# Altium schematic sheet Power_revB3.SchDoc
size A3; SheetNumber: 3; SheetTotal: 3
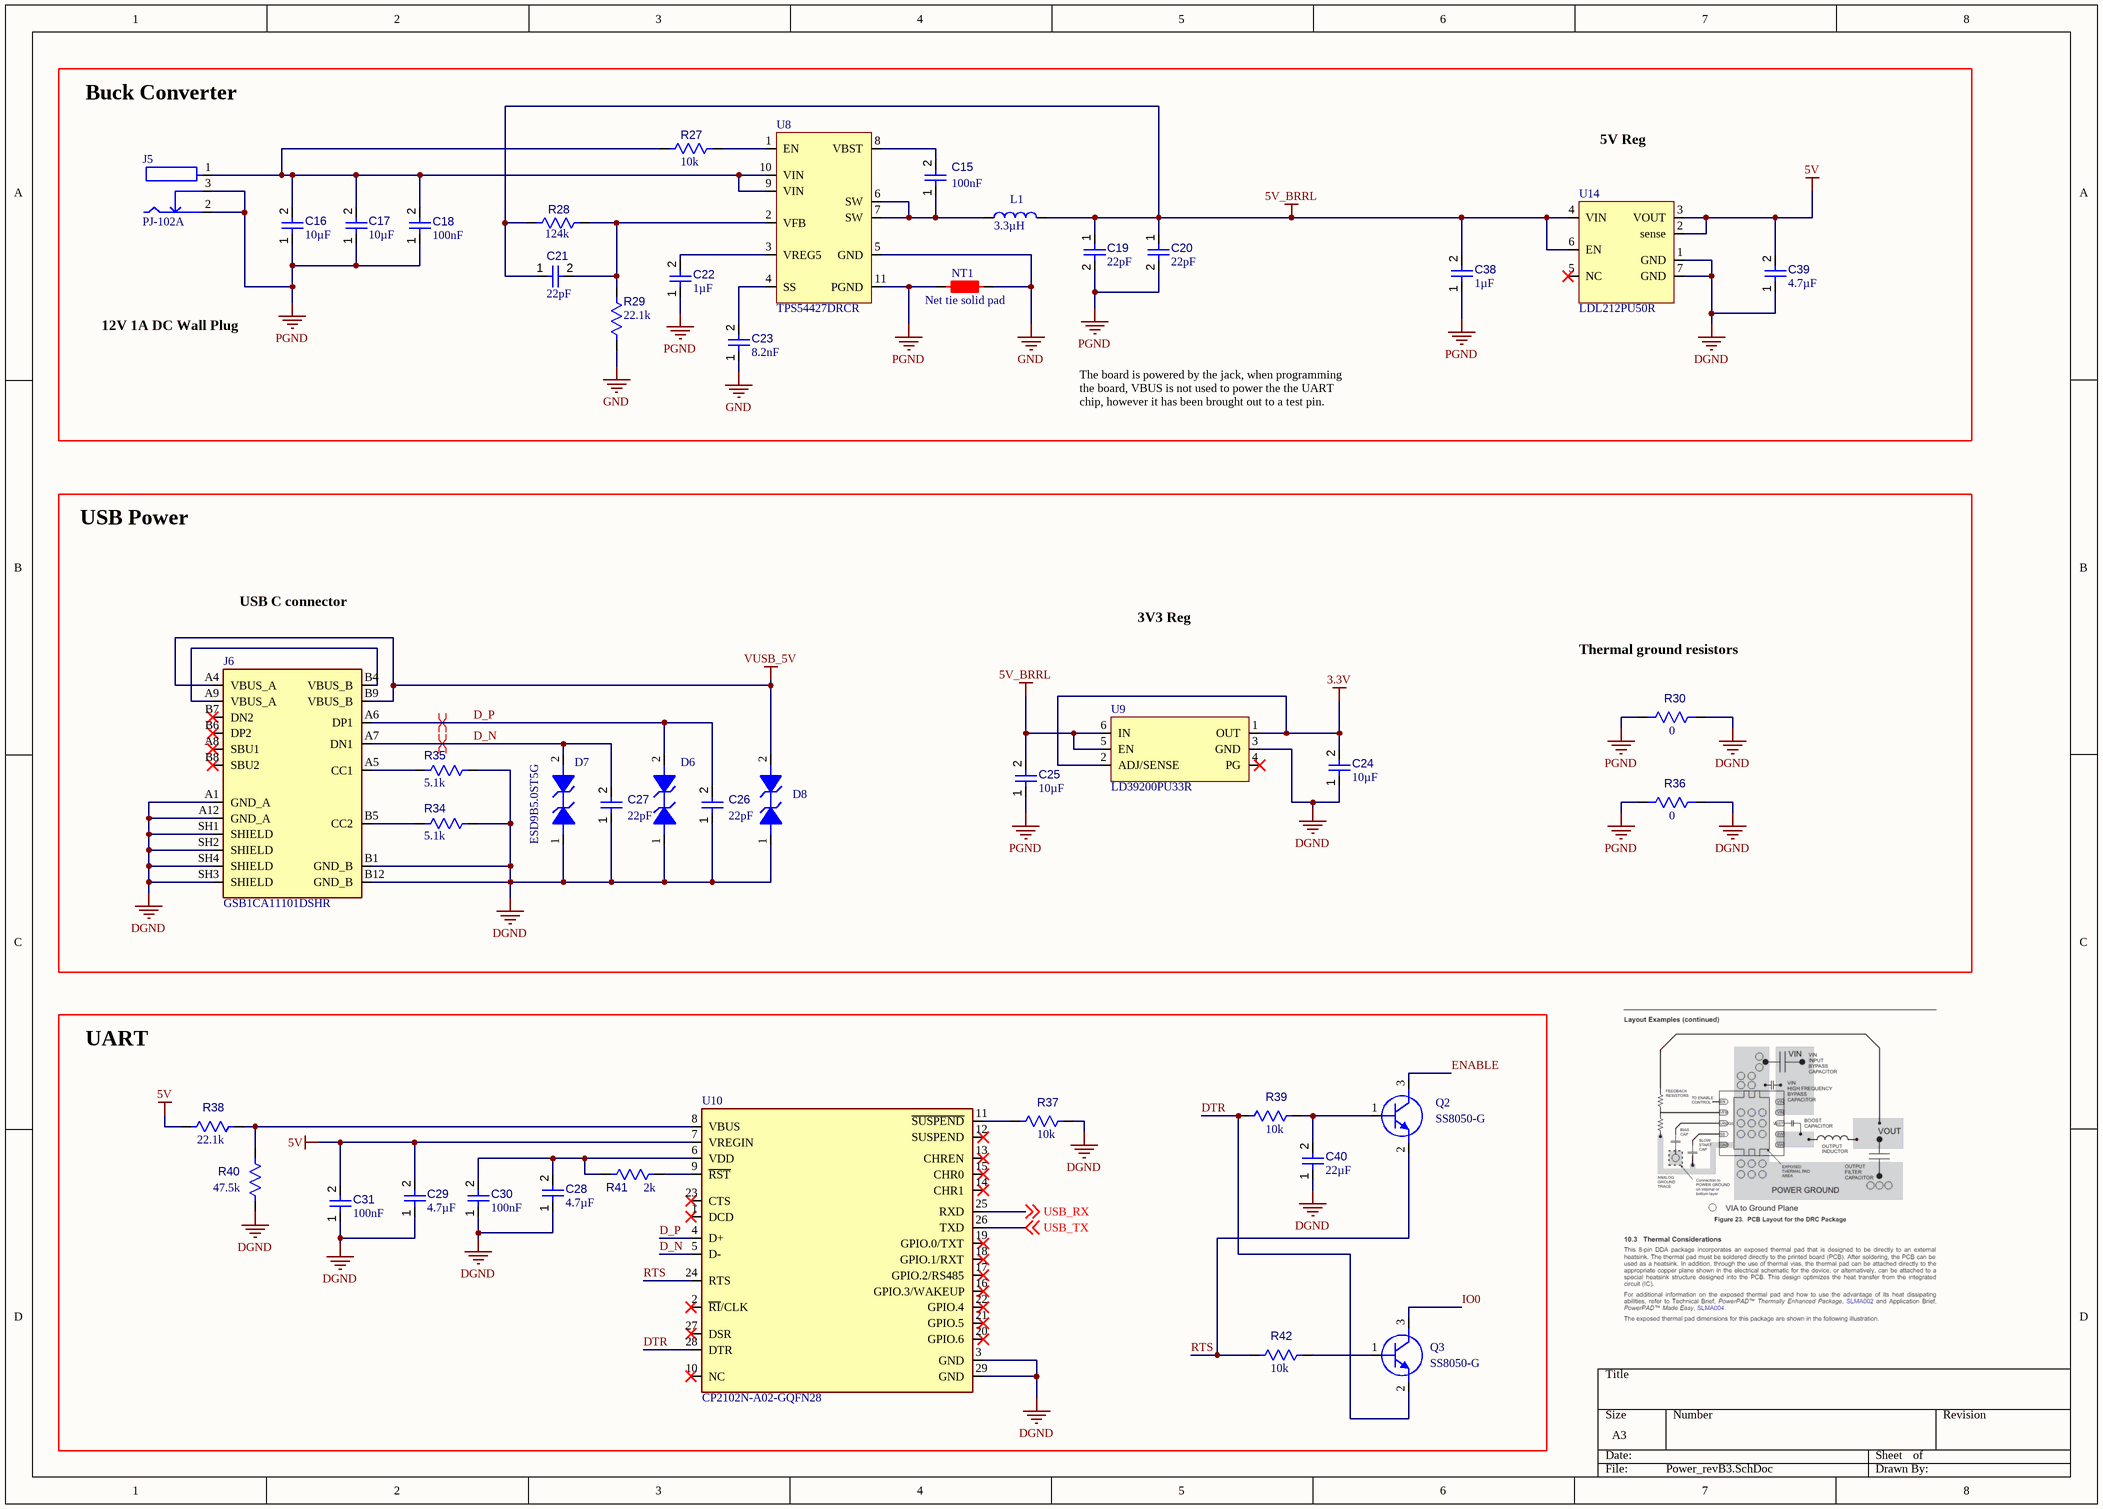
[diagram p0: Power_revB3.SchDoc]

## Parts
C15  value 100nF  [MANUF_CAP_0603]  (hidden comment: CC0603KRX7R7BB104)
C16  value 10µF  [FP-1210-L_3_2_0_3-W_2_5_0-MFG]  (hidden comment: C1210C106M3RACTU)
C17  value 10µF  [FP-1210-L_3_2_0_3-W_2_5_0-MFG]  (hidden comment: C1210C106M3RACTU)
C18  value 100nF  [MANUF_CAP_0603]  (hidden comment: CC0603KRX7R7BB104)
C19  value 22pF  [MANUF_CAP_0603]  (hidden comment: C0603C220J5GACTU)
C20  value 22pF  [MANUF_CAP_0603]  (hidden comment: C0603C220J5GACTU)
C21  value 22pF  [MANUF_CAP_0603]  (hidden comment: C0603C220J5GACTU)
C22  value 1µF  [MANUF_CAP_0603]  (hidden comment: CL10B105KA8NFNC)
C23  value 8.2nF  [FP-GRM188-0_1-e0_2_0_5-MFG]  (hidden comment: GRM1885C1H822JA01D)
C24  value 10µF  [FP-CL21B106KOQNNNE-IPC_A]  (hidden comment: CL21B106KOQNNNE)
C25  value 10µF  [FP-CL21B106KOQNNNE-IPC_A]  (hidden comment: CL21B106KOQNNNE)
C26  value 22pF  [CAPC0402(1005)60_L]  (hidden comment: Capacitor 22pF +/-10% 50V 0402)
C27  value 22pF  [CAPC0402(1005)60_L]  (hidden comment: Capacitor 22pF +/-10% 50V 0402)
C28  value 4.7µF  [MANUF_CAP_0603]  (hidden comment: Capacitor 4.7µF +/-20% 10V 0603)
C29  value 4.7µF  [MANUF_CAP_0603]  (hidden comment: Capacitor 4.7µF +/-20% 10V 0603)
C30  value 100nF  [MANUF_CAP_0603]  (hidden comment: CC0603KRX7R7BB104)
C31  value 100nF  [MANUF_CAP_0603]  (hidden comment: CC0603KRX7R7BB104)
C38  value 1µF  [MANUF_CAP_0603]  (hidden comment: CL10B105KA8NFNC)
C39  value 4.7µF  [MANUF_CAP_0603]  (hidden comment: Capacitor 4.7µF +/-20% 10V 0603)
C40  value 22µF  [FP-GRM21B-0_2-e0_2_0_7-MFG]  (hidden comment: GRM21BZ71A226ME15L)  (no BOM)
D6  ESD9B5.0ST5G  [ONSC-SOD-923-2-514AB-01_V]  (value not drawn)
D7  ESD9B5.0ST5G  [ONSC-SOD-923-2-514AB-01_V]
D8  ESD9B5.0ST5G  [ONSC-SOD-923-2-514AB-01_V]  (value not drawn)
J5  PJ-102A  [FP-PJ-102A-MFG]
J6  GSB1CA11101DSHR  [GSB1CA11101DSHR-Footprint-1]
L1  value 3.3µH  [INDC4141X31N]  (hidden comment: PA5430.332NLT)
NT1  Net tie solid pad  [Net tie solid pad-Footprint-1]  (net tie, no BOM)
Q2  SS8050-G  [FP-SS8050-G-IPC_C]
Q3  SS8050-G  [FP-SS8050-G-IPC_C]
R27  value 10k  [MANUF_RES_0603]  (hidden comment: RC0603FR-0710KL)
R28  value 124k  [RESC0603(1608)_L]  (hidden comment: RCS0603124KFKEA)
R29  value 22.1k  [FP-CRCW0603-HPe3-MFG]  (hidden comment: CRCW060322K1FKEAHP)
R30  value 0  [MANUF_RES_0603]  (hidden comment: Resistor 0R +/- 5% 0603 100 mW)
R34  value 5.1k  [0805]  (hidden comment: RC0805JR-075K1L)
R35  value 5.1k  [0805]  (hidden comment: RC0805JR-075K1L)
R36  value 0  [MANUF_RES_0603]  (hidden comment: Resistor 0R +/- 5% 0603 100 mW)
R37  value 10k  [MANUF_RES_0603]  (hidden comment: RC0603FR-0710KL)
R38  value 22.1k  [MANUF_RES_0603]  (hidden comment: RMCF0603FT22K1)
R39  value 10k  [MANUF_RES_0603]  (hidden comment: RC0603FR-0710KL)
R40  value 47.5k  [MANUF_RES_0603]  (hidden comment: CRCW060347K5FKEAHP)
R41  value 2k  [MANUF_RES_0603]  (hidden comment: ERJ-3EKF2001V)
R42  value 10k  [MANUF_RES_0603]  (hidden comment: RC0603FR-0710KL)
U8  TPS54427DRCR  [SON50P300X100_HS-11N]
U9  LD39200PU33R  [FP-DFN6-7946637-MFG]
U10  CP2102N-A02-GQFN28  [FP-CP2102N-A02-GQFN28-MFG]
U14  LDL212PU50R  [FP-DFN6-7946637-MFG]

## Blocks framed on the sheet
Buck Converter: C15-C23 C38 C39 J5 L1 NT1 R27-R29 U8 U14
USB Power: C24-C27 D6-D8 J6 R30 R34-R36 U9
UART: C28-C31 C40 Q2 Q3 R37-R42 U10

## Nets
3.3V: C24.2 U9.1(OUT) U9.2(ADJ/SENSE)
5V: C29.2 C31.2 C39.2 R38.1 U10.7(VREGIN) U14.2(sense) U14.3(VOUT)
5V_BRRL: C19.1 C20.1 C21.1 C25.2 C38.2 L1.2 R28.1 U9.5(EN) U9.6(IN) U14.4(VIN) U14.6(EN)
DGND: C24.1 C26.1 C27.1 C28.1 C29.1 C30.1 C31.1 C39.1 C40.1 D6.1(A1) D7.1(A1) D8.1(A1) J6.A1(GND_A) J6.A12(GND_A) J6.B1(GND_B) J6.B12(GND_B) J6.SH1(SHIELD) J6.SH2(SHIELD) J6.SH3(SHIELD) J6.SH4(SHIELD) R30.2 R34.1 R35.1 R36.2 R37.1 R40.1 U9.3(GND) U10.3(GND) U10.29(GND) U14.1(GND) U14.7(GND)
GND: C23.1 NT1.2 R29.1 U8.5(GND)
PGND: C16.1 C17.1 C18.1 C19.2 C20.2 C22.1 C25.1 C38.1 J5.2 J5.3 NT1.1 R30.1 R36.1 U8.11(PGND)
VUSB_5V: D8.2(A2) J6.A4(VBUS_A) J6.B9(VBUS_B)
D_N: C27.2 D7.2(A2) J6.A7(DN1) U10.5(D-)
D_P: C26.2 D6.2(A2) J6.A6(DP1) U10.4(D+)
DTR: Q3.2(E) R39.2 U10.28(DTR)
ENABLE: Q2.3(C)
IO0: Q3.3(C)
RTS: Q2.2(E) R42.2 U10.24(RTS)
USB_RX: U10.25(RXD) ; off-sheet USB_RX
USB_TX: U10.26(TXD) ; off-sheet USB_TX
NetC15_1: C15.1 L1.1 U8.6(SW) U8.7(SW)
NetC15_2: C15.2 U8.8(VBST)
NetC16_2: C16.2 C17.2 C18.2 J5.1 R27.2 U8.9(VIN) U8.10(VIN)
NetC21_2: C21.2 R28.2 R29.2 U8.2(VFB)
NetC22_2: C22.2 U8.3(VREG5)
NetC23_2: C23.2 U8.4(SS)
NetC28_2: C28.2 C30.2 R41.2 U10.6(VDD)
NetC40_2: C40.2 Q2.1(B) R39.1
NetJ6_A5: J6.A5(CC1) R35.2
NetJ6_A9: J6.A9(VBUS_A) J6.B4(VBUS_B)
NetJ6_B5: J6.B5(CC2) R34.2
NetQ3_1: Q3.1(B) R42.1
NetR27_1: R27.1 U8.1(EN)
NetR37_2: R37.2 U10.11(~{SUSPEND})
NetR38_2: R38.2 R40.2 U10.8(VBUS)
NetR41_1: R41.1 U10.9(~{RST})

Not connected (* = marked no-connect by the designer): J6 A8(SBU1)* B6(DP2)* B7(DN2)* B8(SBU2)*; U9 4(PG)*; U10 1(DCD)* 2(~{RI}/CLK)* 10(NC)* 12(SUSPEND)* 13(CHREN)* 14(CHR1)* 15(CHR0)* 16(GPIO.3/WAKEUP)* 17(GPIO.2/RS485)* 18(GPIO.1/RXT)* 19(GPIO.0/TXT)* 20(GPIO.6)* 21(GPIO.5)* 22(GPIO.4)* 23(CTS)* 27(DSR)*; U14 5(NC)*

## Layout directives
differential pair: D_N, D_P

## Notes on the sheet
- 5V Reg
- 12V 1A DC Wall Plug
- The board is powered by the jack, when programming the board, VBUS is not used to power the the UART chip, however it has been brought out to a test pin.
- USB C connector
- 3V3 Reg
- Thermal ground resistors

## Library data of the parts
C15 C18 C30 C31 = CMP-001-00099-4: Ceramic Capacitor, Multilayer, Ceramic, 16V, 10% +Tol, 10% -Tol, X7R, 15% TC, 0.1uF, Surface Mount, 0603; Pins: 2; Min Operating Temperature: -55°C; Max Operating Temperature: 125°C; Case/Package: 0603; RoHS Compliant: Yes; Mounting Technology: Surface Mount; Capacitor Type: Ceramic
C16 C17 = CMP-001-00089-3: Ceramic Capacitor, Multilayer, Ceramic, 25V, 20% +Tol, 20% -Tol, X7R, 15% TC, 10uF, Surface Mount, 1210; Capacitor Type: Ceramic; Case/Package: 1210; Min Operating Temperature: -55°C; Max Operating Temperature: 125°C; Pins: 2; Mounting Technology: Surface Mount; RoHS Compliant: Yes
C19-C21 = CMP-001-00095-2: Ceramic Capacitor, Multilayer, Ceramic, 50V, 5% +Tol, 5% -Tol, C0G, 30ppm/Cel TC, 0.000022uF, Surface Mount, 0603; Max Operating Temperature: 125°C; Min Operating Temperature: -55°C; Mounting Technology: Surface Mount; Case/Package: 0603; Pins: 2; Capacitor Type: Ceramic; RoHS Compliant: Yes
C22 C38 = CMP-001-00098-2: Ceramic Capacitor, Multilayer, Ceramic, 25V, 10% +Tol, 10% -Tol, X7R, 15% TC, 1uF, Surface Mount, 0603; Pins: 2; Mounting Technology: Surface Mount; Min Operating Temperature: -55°C; Case/Package: 0603; Capacitor Type: Ceramic; RoHS Compliant: Yes; Max Operating Temperature: 125°C
C23 = CMP-001-00096-1: Ceramic Capacitor, Multilayer, Ceramic, 50V, 5% +Tol, 5% -Tol, C0G, 30ppm/Cel TC, 0.0082uF, Surface Mount, 0603; RoHS Compliant: Yes; Capacitor Type: Ceramic; Min Operating Temperature: -55°C; Mounting Technology: Surface Mount; Max Operating Temperature: 125°C; Pins: 2; Case/Package: 0603
C24 C25 = CMP-001-00101-1: Ceramic Capacitor, Multilayer, Ceramic, 16V, 10% +Tol, 10% -Tol, X7R, 15% TC, 10uF, Surface Mount, 0805; RoHS Compliant: Yes; Max Operating Temperature: 125°C; Capacitor Type: Ceramic; Pins: 2; Min Operating Temperature: -55°C; Case/Package: 0805; Mounting Technology: Surface Mount
C26 C27 = CMP-001-00073-5: Chip Capacitor, 22pF +/-10%, 50V, 0402, Thickness 0.6 mm; Tolerance: 10%; Max Operating Temperature: 85°C; Voltage Rating: 50V; Pins: 2; Case/Package: 0402; Mounting Technology: SMT; Min Operating Temperature: -55°C
C28 C29 C39 = CMP-001-00076-6: Chip Capacitor, 4.7µF +/-20%, 10V, 0603, Thickness 1 mm; Tolerance: 10%; Max Operating Temperature: 85°C; Voltage Rating: 10V; Min Operating Temperature: -55°C; Case/Package: 0603; Mounting Technology: SMT; Pins: 2
C40 = CMP-001-00091-2: Ceramic Capacitor, Multilayer, Ceramic, 10V, 20% +Tol, 20% -Tol, X7R, 15% TC, 22uF, Surface Mount, 0805; Capacitor Type: Ceramic; Min Operating Temperature: -55°C; Pins: 2; Max Operating Temperature: 125°C; Case/Package: 0805; Mounting Technology: Surface Mount; RoHS Compliant: Yes
D6-D8 = CMP-004-00032-1: Trans Voltage Suppressor Diode, 5V V(RWM), Bidirectional, 1 Element, Silicon; Pins: 2; Max Operating Temperature: 150°C; RoHS Compliant: Yes; Min Operating Temperature: -55°C
J5 = CMP-002-00073-7: 16V, 2.5A, 2mm Dia; Connector Type: Circular,Power; Mounting Technology: Board; Voltage Rating: 16V; Max Current Rating: 2.5A; RoHS Compliant: Yes
J6 = CMP-002-00086-1: USB2.0, Type C, Vertical, Height 6.40mm, Dual Row Surface Mount
L1 = CMP-006-00024-1: High Current Composite Inductor - PA5430/PA5431.XXXNLT and PM5430.XXXNLT, Up to 6.6 Apk; Tolerance: 20%; Current Rating: 6.6A
NT1 = CMP-00030-00003-5
Q2 Q3 = CMP-013-00035-2: Small Signal Bipolar Transistor, 1.5A I(C), 25V V(BR)CEO, 1-Element, NPN, Silicon; RoHS Compliant: Yes
R27 R37 R39 R42 = CMP-009-00204-2: Fixed Resistor, Metal Glaze/thick Film, 0.1W, 10000ohm, 75V, 1% +/-Tol, 100ppm/Cel, Surface Mount, 0603; Power: 100mW; Pins: 2; Max Operating Temperature: 155°C; Case/Package: 0603; RoHS Compliant: Yes; Tolerance: 1%; Min Operating Temperature: -55°C; Mounting Technology: Surface Mount
R28 = CMP-009-00198-1: Fixed Resistor, Metal Glaze/thick Film, 0.25W, 124000ohm, 75V, 1% +/-Tol, 100ppm/Cel, Surface Mount, 0603; Tolerance: 1%
R29 = CMP-009-00199-1: Fixed Resistor, Metal Glaze/thick Film, 0.33W, 22100ohm, 75V, 1% +/-Tol, 100ppm/Cel, Surface Mount, 0603; Power: 250mW; Case/Package: 0603; RoHS Compliant: Yes; Min Operating Temperature: -55°C; Pins: 2; Mounting Technology: Surface Mount; Tolerance: 1%; Max Operating Temperature: 155°C
R30 R36 = CMP-009-00006-8: Chip Resistor, 0 Ohm, 0.1 W, -55 to 155 degC, 0603 (1608 Metric); Power: 100mW; Voltage Rating: 50V; Max Operating Temperature: 155°C; RoHS Compliant: True; Mounting Technology: SM; Case/Package: 0603; Min Operating Temperature: -55°C; Tolerance: 5%; Pins: 2
R34 R35 = CMP-009-00191-2: Fixed Resistor, Metal Glaze/thick Film, 0.125W, 5100ohm, 150V, 5% +/-Tol, 100ppm/Cel, Surface Mount, 0805; Power: 125mW; Min Operating Temperature: -55°C; Case/Package: 0805; Pins: 2; Max Operating Temperature: 155°C; Tolerance: 5%; Mounting Technology: Surface Mount; RoHS Compliant: Yes
R38 = CMP-009-00196-2: Fixed Resistor, Metal Glaze/thick Film, 0.1W, 22100ohm, 75V, 1% +/-Tol, 100ppm/Cel, Surface Mount, 0603; Power: 100mW; Case/Package: 0603; Min Operating Temperature: -55°C; RoHS Compliant: Yes; Tolerance: 1%; Max Operating Temperature: 155°C; Pins: 2; Mounting Technology: Surface Mount
R40 = CMP-009-00197-3: Fixed Resistor, Metal Glaze/thick Film, 0.33W, 47500ohm, 75V, 1% +/-Tol, 100ppm/Cel, Surface Mount, 0603; Power: 250mW; Min Operating Temperature: -55°C; RoHS Compliant: Yes; Mounting Technology: Surface Mount; Tolerance: 1%; Case/Package: 0603; Max Operating Temperature: 155°C; Pins: 2
R41 = CMP-009-00207-2: Fixed Resistor, Metal Glaze/thick Film, 0.1W, 2000ohm, 75V, 1% +/-Tol, 100ppm/Cel, Surface Mount, 0603; Power: 100mW; RoHS Compliant: Yes; Pins: 2; Max Operating Temperature: 155°C; Case/Package: 0603; Tolerance: 1%; Mounting Technology: Surface Mount; Min Operating Temperature: -55°C
U8 = CMP-019-00051-7: Switching Regulator, Current-mode, 4A, 650kHz Switching Freq-Max, PDSO10; Max Supply Voltage: 18V; Max Operating Temperature: 85°C; Frequency: 650kHz; RoHS Compliant: Yes; Pins: 10; Case/Package: HVSON; Min Operating Temperature: -40°C
U9 = CMP-019-00050-2: Fixed Positive LDO Regulator, 3.3V, 0.25V Dropout; Max Supply Voltage: 6V; Case/Package: HVSON; Pins: 6; RoHS Compliant: Yes
U10 = CMP-00024-00008-3: USB Bus Controller, CMOS
U14 = CMP-019-00053-2: Fixed Positive LDO Regulator, 5V, 0.6V Dropout; RoHS Compliant: Yes